# Altium schematic sheet MotorCtrl.SchDoc
size A4; Organization: Altium Limited; Address1: L3, 12a Rodborough Rd; Address2: Frenchs Forest; Address3: NSW; Address4: Australia 2086; SheetNumber: 3; SheetTotal: 5; SPICEModelCacheSOUJEWZH: <root> / <DocumentId>SOUJEWZH</DocumentId> / <CacheFrame Number="0"> / <Model Name="cap" Kind="MDL"> / <Text>*Default semiconductor capacitor / .MODEL CAP C()</Text> / </Model> / </CacheFrame> / </root>
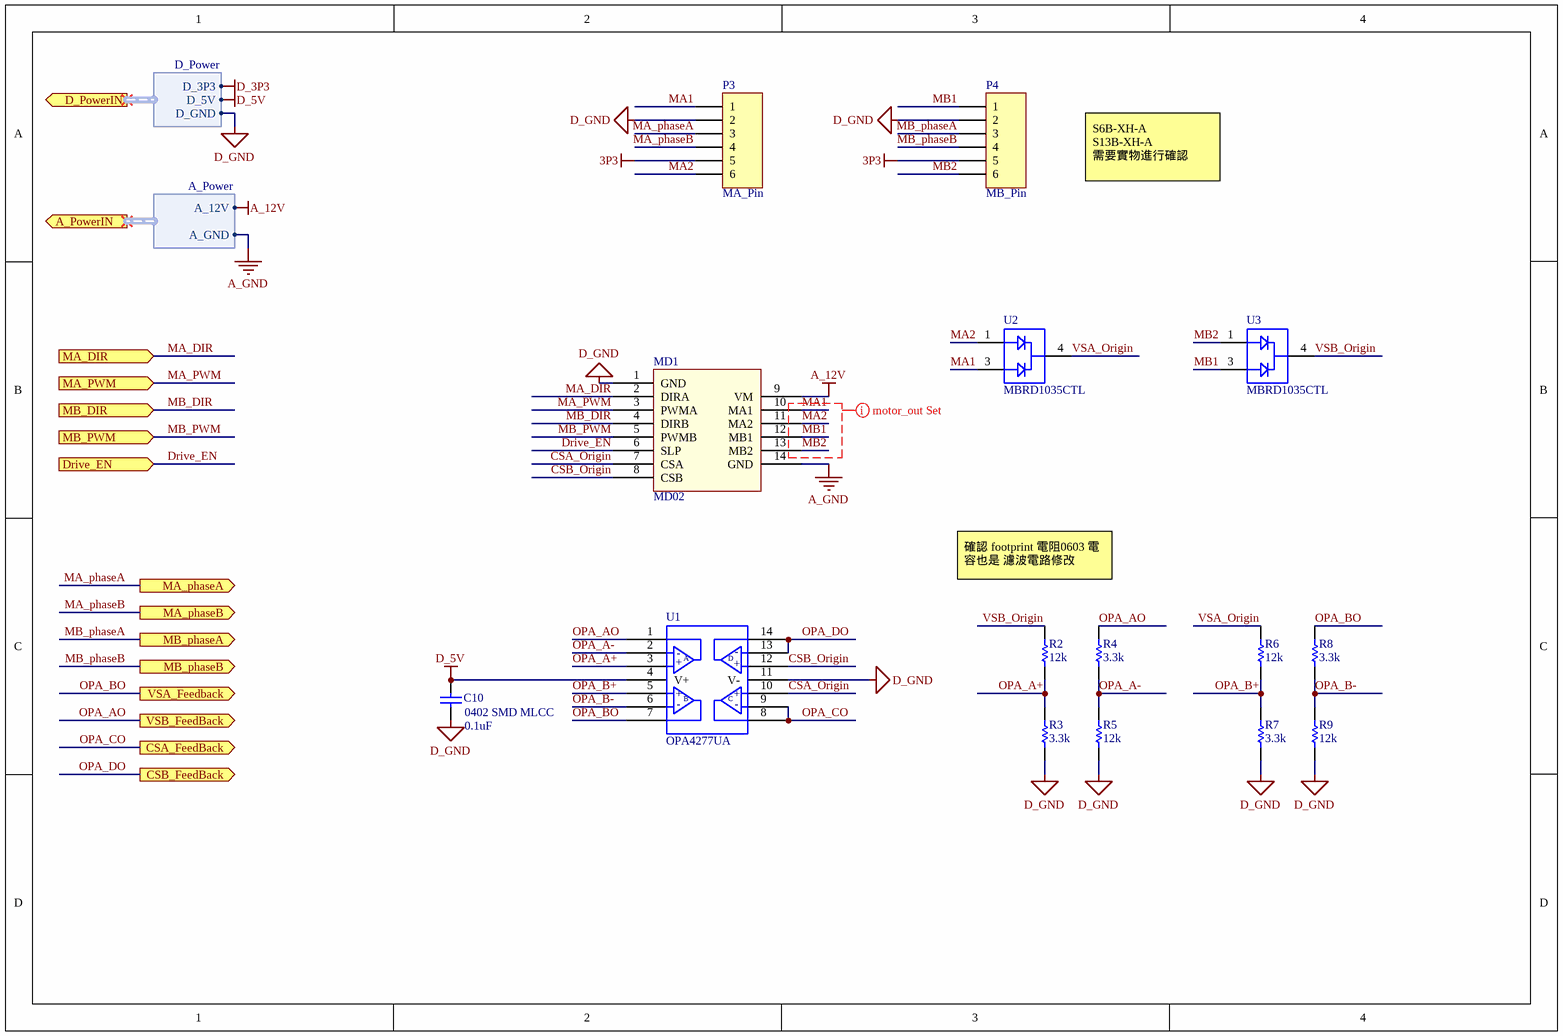
[diagram p0: MotorCtrl.SchDoc]

## Parts
C10  0402 SMD MLCC  value 0.1uF  [0402]
MD1  MD02  [MOTOR_DRIVER]
P3  MA_Pin  [S6B-XH-A]
P4  MB_Pin  [S6B-XH-A]
R2  12k  [0402 SMD Res]
R3  3.3k  [0402 SMD Res]
R4  3.3k  [0402 SMD Res]
R5  12k  [0402 SMD Res]
R6  12k  [0402 SMD Res]
R7  3.3k  [0402 SMD Res]
R8  3.3k  [0402 SMD Res]
R9  12k  [0402 SMD Res]
U1  OPA4277UA  [OPA4277UA]
U2  MBRD1035CTL  [MBRD1035CTL]
U3  MBRD1035CTL  [MBRD1035CTL]

## Ports
A_PowerIN (out, harness A_Power), CSA_FeedBack (out), CSB_FeedBack (out), D_PowerIN (out, harness D_Power), Drive_EN (in), MA_DIR (in), MA_phaseA (out), MA_phaseB (out), MA_PWM (in), MB_DIR (in), MB_phaseA (out), MB_phaseB (out), MB_PWM (in), VSA_Feedback (out), VSB_FeedBack (out)

## Harnesses
D_Power: D_3P3, D_5V, D_GND
A_Power: A_12V, A_GND

## Nets
3P3: P3.5 P4.5
A_12V: MD1.9(VM) ; port A_PowerIN.A_12V
A_GND: MD1.14(GND) ; port A_PowerIN.A_GND
D_3P3: port D_PowerIN.D_3P3
D_5V: C10.1 U1.4(V+) ; port D_PowerIN.D_5V
D_GND: C10.2 MD1.1(GND) P3.2 P4.2 R3.2 R5.1 R7.2 R9.1 U1.11(V-) ; port D_PowerIN.D_GND
CSA_Origin: MD1.7(CSA) U1.10(+in_C)
CSB_Origin: MD1.8(CSB) U1.12(+In_D)
Drive_EN: MD1.6(SLP) ; port Drive_EN
MA1: MD1.10(MA1) P3.1 U2.3
MA2: MD1.11(MA2) P3.6 U2.1
MA_DIR: MD1.2(DIRA) ; port MA_DIR
MA_phaseA: P3.3 ; port MA_phaseA
MA_phaseB: P3.4 ; port MA_phaseB
MA_PWM: MD1.3(PWMA) ; port MA_PWM
MB1: MD1.12(MB1) P4.1 U3.3
MB2: MD1.13(MB2) P4.6 U3.1
MB_DIR: MD1.4(DIRB) ; port MB_DIR
MB_phaseA: P4.3 ; port MB_phaseA
MB_phaseB: P4.4 ; port MB_phaseB
MB_PWM: MD1.5(PWMB) ; port MB_PWM
OPA_A+: R2.2 R3.1 U1.3(+In_A)
OPA_A-: R4.1 R5.2 U1.2(-In_A)
OPA_AO: R4.2 U1.1(Out_A) ; port VSB_FeedBack
OPA_B+: R6.2 R7.1 U1.5(+In_B)
OPA_B-: R8.1 R9.2 U1.6(-In_B)
OPA_BO: R8.2 U1.7(Out_B) ; port VSA_Feedback
OPA_CO: U1.8(Out_C) U1.9(-In_C) ; port CSA_FeedBack
OPA_DO: U1.13(-In_D) U1.14(Out_D) ; port CSB_FeedBack
VSA_Origin: R6.1 U2.4
VSB_Origin: R2.1 U3.4

## Layout directives
net class motor_out; rule Clearance Constraint [Generic clearance = 0.65mm, and 9 value(s) for objects]; rule Width Constraint [Pref Width = 0.381mm    Min Width = 0.254mm    Max Width = 0.381mm]; rule Routing Via Style [Pref Size = 20mil    Pref Hole Size = 10mil]: MA1, MA2, MB1, MB2

## Notes on the sheet
- S6B-XH-A
  S13B-XH-A
  需要實物進行確認
- 確認 footprint 電阻0603 電容也是 濾波電路修改
- Title
- Size:
- Date:
- A4
- Number:
- Time:
- Revision:
- Sheet
- of
- File:
- (in symbol Small Signal Amplifier) －; A; D; +; B; C

## Library data of the parts
C10 = Cap Semi: Capacitor (Semiconductor SIM Model); Published: 8-Jun-2000; LatestRevisionDate: 29-May-2009; LatestRevisionNote: IPC-7351 Footprint Added.; PackageReference: C1206; Publisher: Altium Limited; PackageDescription: Chip Capacitor
MD1 = Motor Driver: 17A 2 Cheel Motor Driver; buy_link: https://www.ruten.com.tw/item/show?21811773783671
P3 P4 = Header 6: S6B-XH-A; LatestRevisionDate: 17-Jul-2002; LatestRevisionNote: Re-released for DXP Platform.; Publisher: Altium Limited
R2-R9 = Res1: Resistor; Published: 8-Jun-2000; LatestRevisionDate: 17-Jul-2002; LatestRevisionNote: Re-released for DXP Platform.; PackageReference: AXIAL-0.3; Publisher: Altium Limited; PackageDescription: Axial Device, Thru-Hole; 2 Leads; 0.3 in Pin Spacing
U1 = Small Signal Amplifier: buy_link: https://www.ruten.com.tw/item/show?22015419000992; datasheet: https://datasheet.ciiva.com/27050/905643-27050822.pdf?src-supplier=Jameco
U2 U3 = Diode IC: 35V 10A 2 Cheel Diode; buy_link: https://www.ruten.com.tw/item/show?21744290003226; datasheet: https://datasheet.ciiva.com/905/mbrd1035ctl-d-905952.pdf?src-supplier=Digi-Key